# Altium schematic sheet Analog.SchDoc
size A4
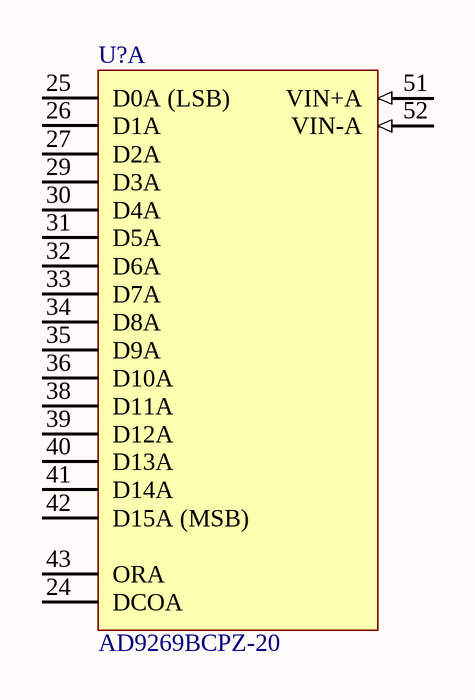
[diagram p0: Analog.SchDoc]

## Parts
U?  AD9269BCPZ-20  [CP-64-4_N]  (part A of 4)

## Nets

Not connected (* = marked no-connect by the designer): U? 24(DCOA) 25(D0A_(LSB)) 26(D1A) 27(D2A) 29(D3A) 30(D4A) 31(D5A) 32(D6A) 33(D7A) 34(D8A) 35(D9A) 36(D10A) 38(D11A) 39(D12A) 40(D13A) 41(D14A) 42(D15A_(MSB)) 43(ORA) 51(VIN+A) 52(VIN-A)

## Library data of the parts
U? = CMP-0313-00456-2: Dual 16-Bit Analog-to-Digital Converter with Parallel Interface, 1.8 V, 20MSPS, -40 to +85 degC, CP-64-4, Pb-Free, Tray; Manufacturer: Analog Devices; Generic Part Number: AD9269-20; Channels: 2; Throughput Rate (SPS): 20M; Resolution (Bits): 16; Interface: Par; DatasheetVersion: Rev.0; ComponentLink4URL: http://www.analog.com/en/analog-to-digital-converters/ad-converters/ad9269/products/product.html; ComponentLink1URL: http://www.analog.com/en/index.html; PartNumber: AD9269BCPZ-20; Mounting Technology: Surface Mount; PackageDescription: 64-Lead Lead Frame Chip Scale Package [LFCSP_VQ] 9 x 9 mm Body, Very Thin Quad; RoHS: Y; PackageVersion: 051007-C; ComponentLink3Description: Package Specification; ComponentLink2URL: http://www.analog.com/static/imported-files/data_sheets/AD9269.pdf; ComponentLink1Description: Manufacturer URL; PackageReference: CP-64-4; Code_JEDEC: MO-220-VMMD-4; ComponentLink2Description: Datasheet; Packing: Tray; ComponentLink4Description: Product URL; ComponentLink3URL: http://www.analog.com/static/imported-files/packages/PKG_PDF/LFCSP(CP)/CP_64_4.pdf